# Altium schematic sheet Memory-QSPI_Flash-eMMC.SchDoc
size A3; SheetNumber: 22; SheetTotal: 32
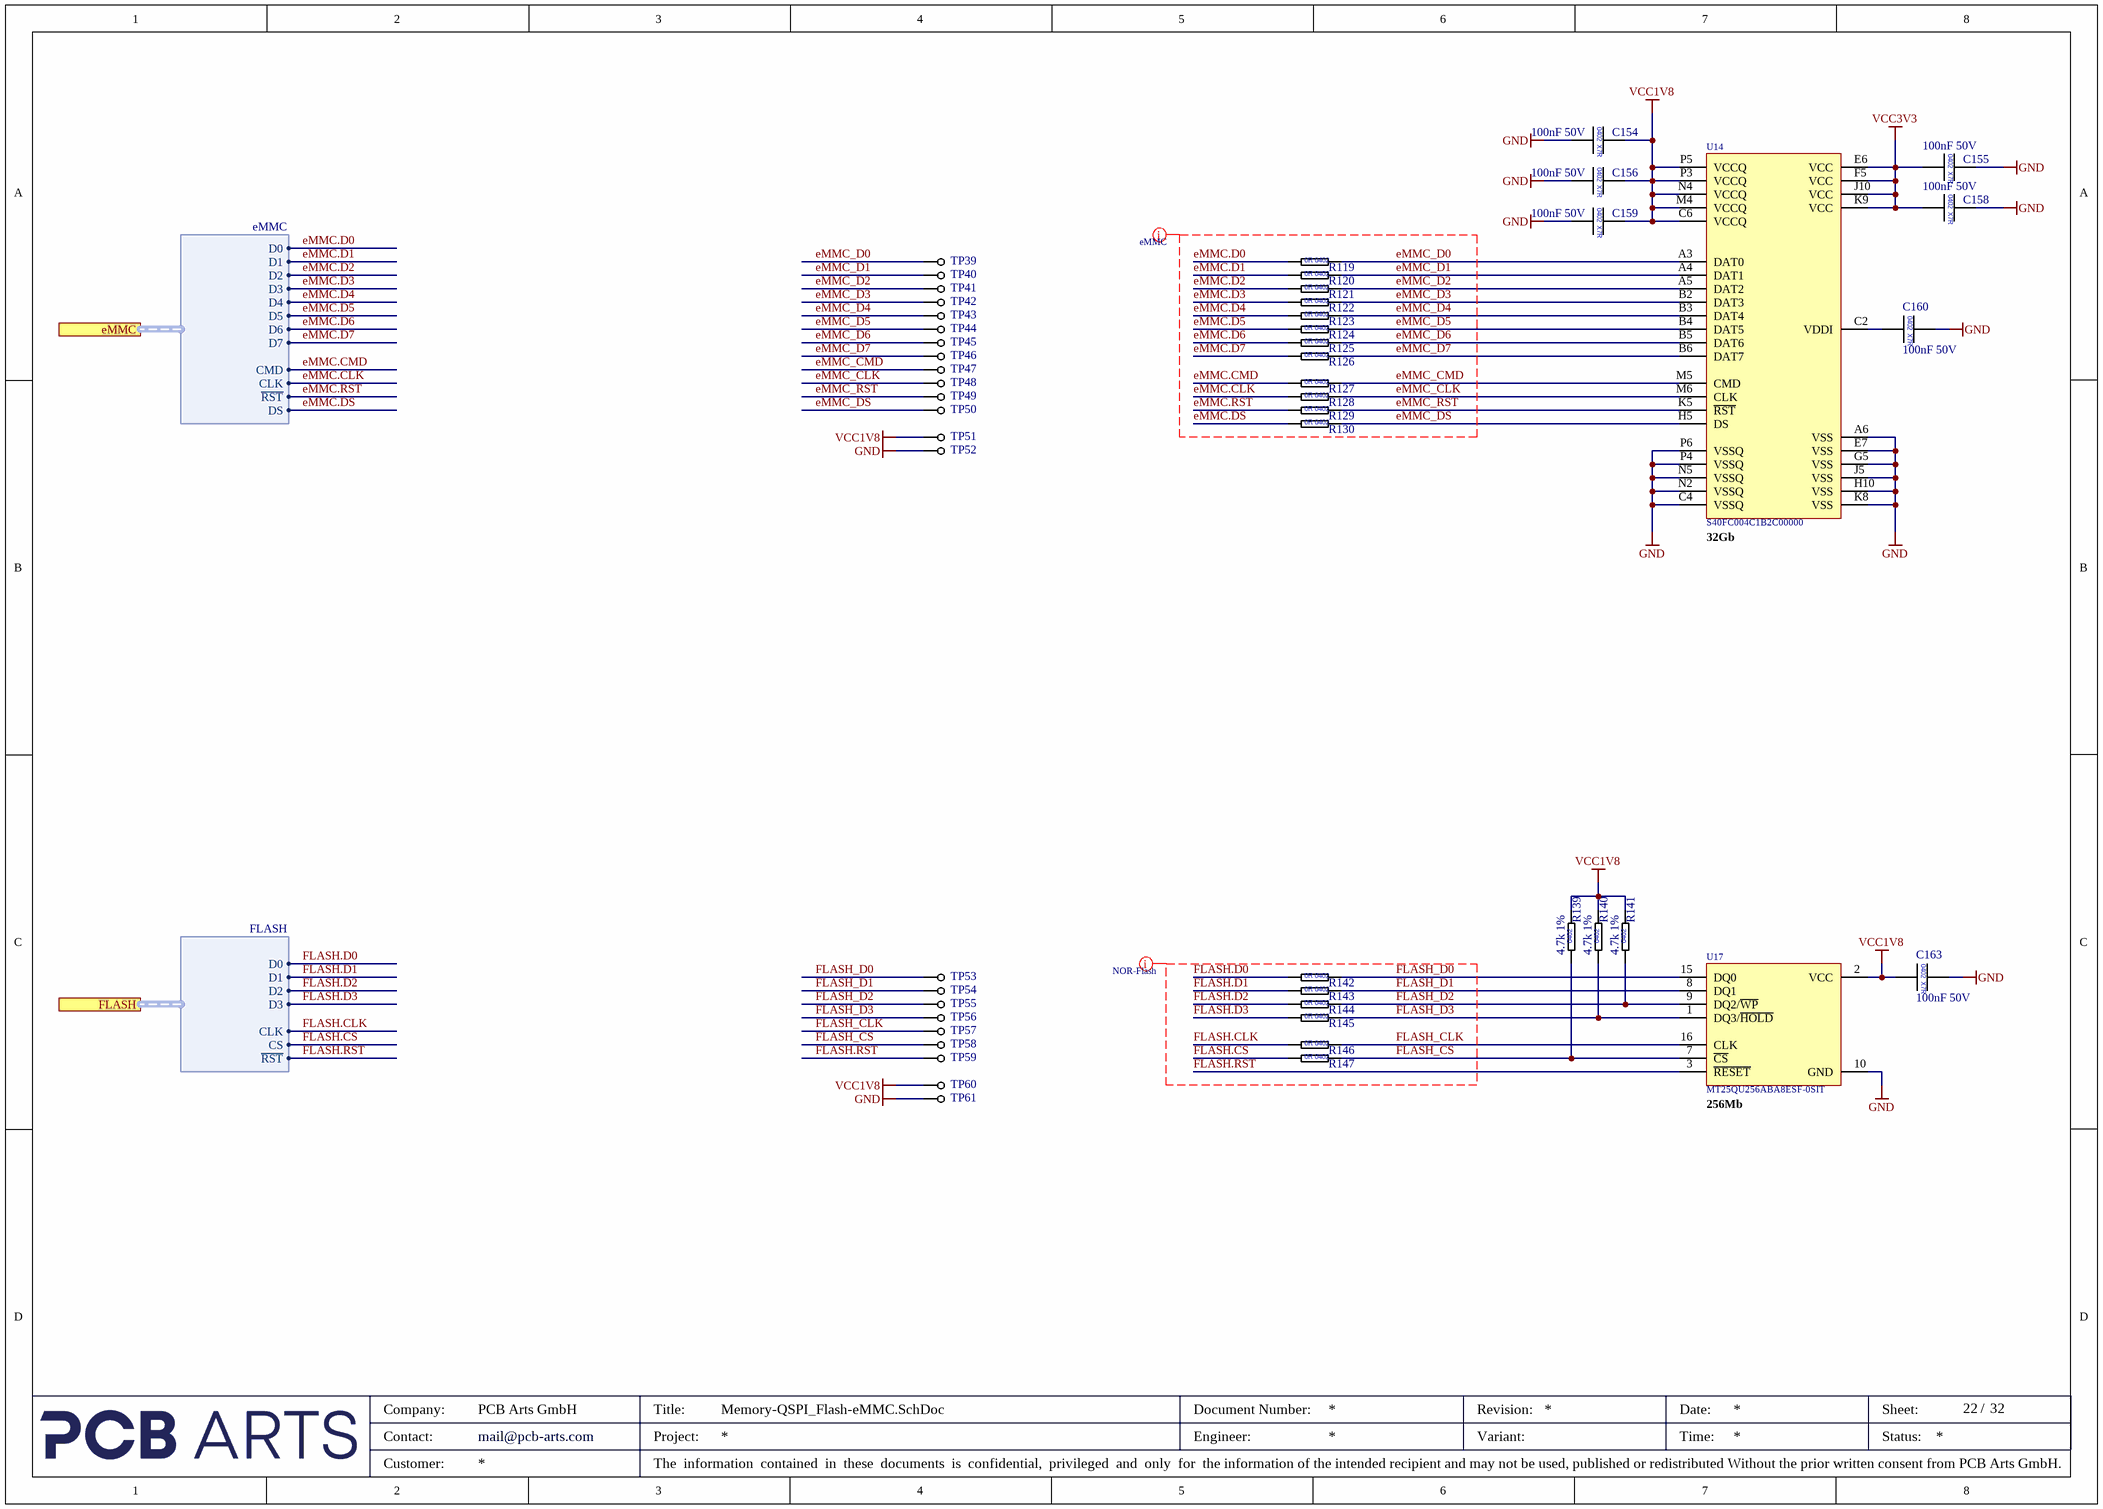
[diagram p0: Memory-QSPI_Flash-eMMC.SchDoc]

## Parts
C154  100nF 50V  [CAP_0402_L]
C155  100nF 50V  [CAP_0402_L]
C156  100nF 50V  [CAP_0402_L]
C158  100nF 50V  [CAP_0402_L]
C159  100nF 50V  [CAP_0402_L]
C160  100nF 50V  [CAP_0402_L]
C163  100nF 50V  [CAP_0402_L]
R119  0R Jumper  [RES_0402_L]  (value not drawn)
R120  0R Jumper  [RES_0402_L]  (value not drawn)
R121  0R Jumper  [RES_0402_L]  (value not drawn)
R122  0R Jumper  [RES_0402_L]  (value not drawn)
R123  0R Jumper  [RES_0402_L]  (value not drawn)
R124  0R Jumper  [RES_0402_L]  (value not drawn)
R125  0R Jumper  [RES_0402_L]  (value not drawn)
R126  0R Jumper  [RES_0402_L]  (value not drawn)
R127  0R Jumper  [RES_0402_L]  (value not drawn)
R128  0R Jumper  [RES_0402_L]  (value not drawn)
R129  0R Jumper  [RES_0402_L]  (value not drawn)
R130  0R Jumper  [RES_0402_L]  (value not drawn)
R139  4.7k 1%  [RES_0402_L]
R140  4.7k 1%  [RES_0402_L]
R141  4.7k 1%  [RES_0402_L]
R142  0R Jumper  [RES_0402_L]  (value not drawn)
R143  0R Jumper  [RES_0402_L]  (value not drawn)
R144  0R Jumper  [RES_0402_L]  (value not drawn)
R145  0R Jumper  [RES_0402_L]  (value not drawn)
R146  0R Jumper  [RES_0402_L]  (value not drawn)
R147  0R Jumper  [RES_0402_L]  (value not drawn)
TP39  Testpoint  [Testpoint 0.8mm]  (value not drawn)  (no BOM)
TP40  Testpoint  [Testpoint 0.8mm]  (value not drawn)  (no BOM)
TP41  Testpoint  [Testpoint 0.8mm]  (value not drawn)  (no BOM)
TP42  Testpoint  [Testpoint 0.8mm]  (value not drawn)  (no BOM)
TP43  Testpoint  [Testpoint 0.8mm]  (value not drawn)  (no BOM)
TP44  Testpoint  [Testpoint 0.8mm]  (value not drawn)  (no BOM)
TP45  Testpoint  [Testpoint 0.8mm]  (value not drawn)  (no BOM)
TP46  Testpoint  [Testpoint 0.8mm]  (value not drawn)  (no BOM)
TP47  Testpoint  [Testpoint 0.8mm]  (value not drawn)  (no BOM)
TP48  Testpoint  [Testpoint 0.8mm]  (value not drawn)  (no BOM)
TP49  Testpoint  [Testpoint 0.8mm]  (value not drawn)  (no BOM)
TP50  Testpoint  [Testpoint 0.8mm]  (value not drawn)  (no BOM)
TP51  Testpoint  [Testpoint 0.8mm]  (value not drawn)  (no BOM)
TP52  Testpoint  [Testpoint 0.8mm]  (value not drawn)  (no BOM)
TP53  Testpoint  [Testpoint 0.8mm]  (value not drawn)  (no BOM)
TP54  Testpoint  [Testpoint 0.8mm]  (value not drawn)  (no BOM)
TP55  Testpoint  [Testpoint 0.8mm]  (value not drawn)  (no BOM)
TP56  Testpoint  [Testpoint 0.8mm]  (value not drawn)  (no BOM)
TP57  Testpoint  [Testpoint 0.8mm]  (value not drawn)  (no BOM)
TP58  Testpoint  [Testpoint 0.8mm]  (value not drawn)  (no BOM)
TP59  Testpoint  [Testpoint 0.8mm]  (value not drawn)  (no BOM)
TP60  Testpoint  [Testpoint 0.8mm]  (value not drawn)  (no BOM)
TP61  Testpoint  [Testpoint 0.8mm]  (value not drawn)  (no BOM)
U14  S40FC004C1B2C00000  [BGA50P900X750X080-153N]
U17  MT25QU256ABA8ESF-0SIT  [SOIC16_Widebody]

## Ports
eMMC (harness eMMC, see Top-Level-Sheet[3B], Bank 0_Bank 14[8A]), FLASH (harness FLASH, see Top-Level-Sheet[3B], Bank 0_Bank 14[8C])

## Harnesses
FLASH: D0, D1, D2, D3, CLK, CS, ~{RST}
eMMC: D0, D1, D2, D3, CLK, CMD, ~{RST}, D4, D5, D6, D7, DS

## Nets
GND: C154.2 C155.1 C156.2 C158.1 C159.2 C160.1 C163.1 TP52.1(GND) TP61.1(GND) U14.A6(VSS) U14.C4(VSSQ) U14.E7(VSS) U14.G5(VSS) U14.H10(VSS) U14.J5(VSS) U14.K8(VSS) U14.N2(VSSQ) U14.N5(VSSQ) U14.P4(VSSQ) U14.P6(VSSQ) U17.10(GND)
VCC1V8: C154.1 C156.1 C159.1 C163.2 R139.2 R140.2 R141.2 TP51.1(GND) TP60.1(GND) U14.C6(VCCQ) U14.M4(VCCQ) U14.N4(VCCQ) U14.P3(VCCQ) U14.P5(VCCQ) U17.2(VCC)
VCC3V3: C155.2 C158.2 U14.E6(VCC) U14.F5(VCC) U14.J10(VCC) U14.K9(VCC)
eMMC.CLK: R128.1 ; port eMMC.CLK
eMMC.CMD: R127.1 ; port eMMC.CMD
eMMC.D0: R119.1 ; port eMMC.D0
eMMC.D1: R120.1 ; port eMMC.D1
eMMC.D2: R121.1 ; port eMMC.D2
eMMC.D3: R122.1 ; port eMMC.D3
eMMC.D4: R123.1 ; port eMMC.D4
eMMC.D5: R124.1 ; port eMMC.D5
eMMC.D6: R125.1 ; port eMMC.D6
eMMC.D7: R126.1 ; port eMMC.D7
eMMC.DS: R130.1 ; port eMMC.DS
eMMC.~{RST}: R129.1 ; port eMMC.~{RST}
eMMC_CLK: R128.2 TP48.1(GND) U14.M6(CLK)
eMMC_CMD: R127.2 TP47.1(GND) U14.M5(CMD)
eMMC_D0: R119.2 TP39.1(GND) U14.A3(DAT0)
eMMC_D1: R120.2 TP40.1(GND) U14.A4(DAT1)
eMMC_D2: R121.2 TP41.1(GND) U14.A5(DAT2)
eMMC_D3: R122.2 TP42.1(GND) U14.B2(DAT3)
eMMC_D4: R123.2 TP43.1(GND) U14.B3(DAT4)
eMMC_D5: R124.2 TP44.1(GND) U14.B4(DAT5)
eMMC_D6: R125.2 TP45.1(GND) U14.B5(DAT6)
eMMC_D7: R126.2 TP46.1(GND) U14.B6(DAT7)
eMMC_DS: R130.2 TP50.1(GND) U14.H5(DS)
eMMC_~{RST}: R129.2 TP49.1(GND) U14.K5(~{RST})
FLASH.~{CS}: R147.1 ; port FLASH.CS
FLASH.CLK: R146.1 ; port FLASH.CLK
FLASH.D0: R142.1 ; port FLASH.D0
FLASH.D1: R143.1 ; port FLASH.D1
FLASH.D2: R144.1 ; port FLASH.D2
FLASH.D3: R145.1 ; port FLASH.D3
FLASH.~{RST}: TP59.1(GND) U17.3(~{RESET}) ; port FLASH.~{RST}
FLASH_~{CS}: R139.1 R147.2 TP58.1(GND) U17.7(~{CS})
FLASH_CLK: R146.2 TP57.1(GND) U17.16(CLK)
FLASH_D0: R142.2 TP53.1(GND) U17.15(DQ0)
FLASH_D1: R143.2 TP54.1(GND) U17.8(DQ1)
FLASH_D2: R141.1 R144.2 TP55.1(GND) U17.9(DQ2/~{WP})
FLASH_D3: R140.1 R145.2 TP56.1(GND) U17.1(DQ3/~{HOLD})
NetC160_2: C160.2 U14.C2(VDDI)

## Layout directives
net class eMMC: eMMC.CLK, eMMC.CMD, eMMC.D0, eMMC.D1, eMMC.D2, eMMC.D3, eMMC.D4, eMMC.D5, eMMC.D6, eMMC.D7, eMMC.DS, eMMC.~{RST}, eMMC_CLK, eMMC_CMD, eMMC_D0, eMMC_D1, eMMC_D2, eMMC_D3, eMMC_D4, eMMC_D5, eMMC_D6, eMMC_D7, eMMC_DS, eMMC_~{RST}
net class NOR-Flash: FLASH.CLK, FLASH.D0, FLASH.D1, FLASH.D2, FLASH.D3, FLASH.~{CS}, FLASH.~{RST}, FLASH_CLK, FLASH_D0, FLASH_D1, FLASH_D2, FLASH_D3, FLASH_~{CS}

## Notes on the sheet
- (near U14) 32Gb
- (near U17) 256Mb
- Company:
- Contact:
- Customer:
- mail@pcb-arts.com
- PCB Arts GmbH
- Title:
- Project:
- The  information  contained  in  these  documents  is  confidential,  privileged  and  only  for  the information of the intended recipient and may not be used, published or redistributed Without the prior written consent from PCB Arts GmbH.
- Engineer:
- Document Number:
- Revision:
- Variant:
- Date:
- Time:
- Sheet:
- Status:
- /
- (in symbol CAP_0402_100nF_50V) 0402; X7R
- (in symbol RES_0402_0R Jumper) 0R 0402
- (in symbol RES_0402_4.7k_1%) 0402

## Library data of the parts
C154-C156 C158-C160 C163 = CAP_0402_100nF_50V: Multilayer Ceramic Capacitors MLCC - SMD/SMT 0402 50VDC; Manufacturer 1: Murata Electronics; Manufacturer 1 Prt. Nr.: GCM155L8EH104KE07D; Manufacturer 2 Prt. Nr.: UMK105B7104KV-FR; Manufacturer 2: TDK
R119-R130 R142-R147 = RES_0402_0R Jumper: Thick Film Resistors - SMD 0Ohm; Manufacturer 1: Vishay / Dale; Manufacturer 1 Prt. Nr.: CRCW04020000Z0EDC; Manufacturer 2 Prt. Nr.: RC0402JR-070RL; Manufacturer 2: Yageo
R139-R141 = RES_0402_4.7k_1%: Thick Film Resistors - SMD 4.7kOhm 1%; Manufacturer 1: Vishay / Dale; Manufacturer 1 Prt. Nr.: CRCW04024K70FKEDC; Manufacturer 2 Prt. Nr.: RC0402FR-134K7L; Manufacturer 2: Yageo
TP39-TP61 = Testpoint 0.8mm
U14 = S40FC004C1B2C00000_eMMC 4GB e.MMC5.1 BGA 9.0 x 7.5 x 0.8 mm: eMMC 4GB e.MMC5.1 BGA 9.0 x 7.5 x 0.8 mm; Manufacturer 1: SkyHigh Memory; Manufacturer 1 Prt. Nr.: S40FC004C1B2C00000
U17 = MT25QU256ABA8ESF-0SIT_NOR-Flash SPI 256Mbit NOR-Flash /1.8V: NOR-Flash SPI 256Mbit NOR-Flash /1.8V; Manufacturer 1: Micron; Manufacturer 1 Prt. Nr.: MT25QU256ABA8ESF-0SIT